# Altium schematic sheet Tower & AI.SchDoc
size A4
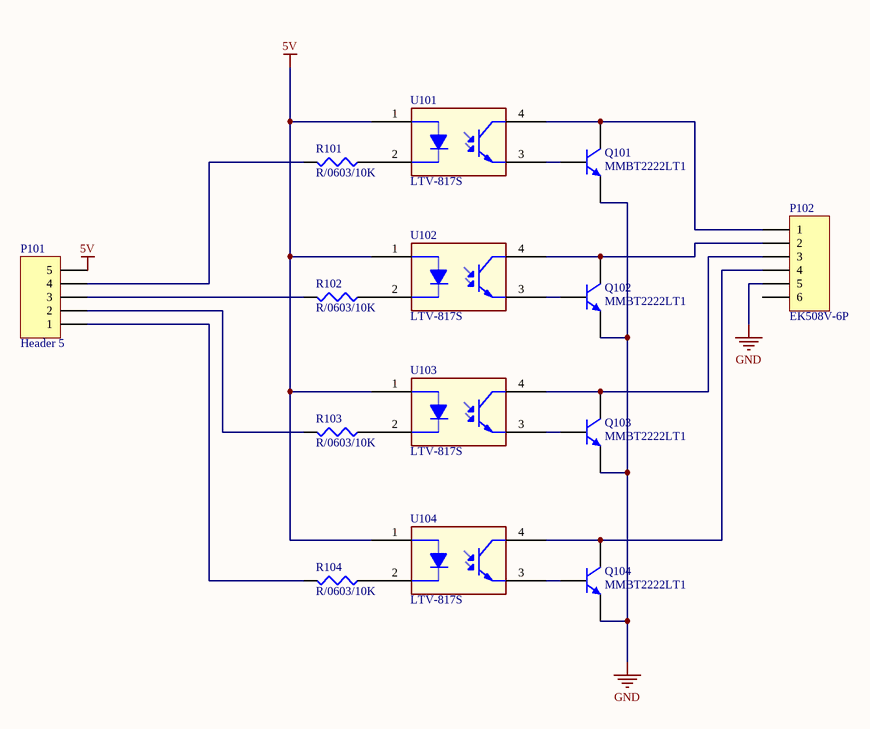
[diagram p0: Tower & AI.SchDoc]

## Parts
P101  Header 5  [HDR1X5]
P102  EK508V-6P  [EK508V-6P]
Q101  MMBT2222LT1  [SO-G3/C2.25]
Q102  MMBT2222LT1  [SO-G3/C2.25]
Q103  MMBT2222LT1  [SO-G3/C2.25]
Q104  MMBT2222LT1  [SO-G3/C2.25]
R101  R/0603/10K  [R_SMD_0603]
R102  R/0603/10K  [R_SMD_0603]
R103  R/0603/10K  [R_SMD_0603]
R104  R/0603/10K  [R_SMD_0603]
U101  LTV-817S  [U_SMD4_PC817]
U102  LTV-817S  [U_SMD4_PC817]
U103  LTV-817S  [U_SMD4_PC817]
U104  LTV-817S  [U_SMD4_PC817]

## Nets
5V: P101.5 U101.1(A) U102.1(A) U103.1(A) U104.1(A)
GND: P102.5 Q101.2(E) Q102.2(E) Q103.2(E) Q104.2(E)
NetP101_1: P101.1 R104.2
NetP101_2: P101.2 R103.2
NetP101_3: P101.3 R102.2
NetP101_4: P101.4 R101.2
NetP102_1: P102.1 Q101.3(C) U101.4(C)
NetP102_2: P102.2 Q102.3(C) U102.4(C)
NetP102_3: P102.3 Q103.3(C) U103.4(C)
NetP102_4: P102.4 Q104.3(C) U104.4(C)
NetQ101_1: Q101.1(B) U101.3(E)
NetQ102_1: Q102.1(B) U102.3(E)
NetQ103_1: Q103.1(B) U103.3(E)
NetQ104_1: Q104.1(B) U104.3(E)
NetR101_1: R101.1 U101.2(C)
NetR102_1: R102.1 U102.2(C)
NetR103_1: R103.1 U103.2(C)
NetR104_1: R104.1 U104.2(C)

Not connected (* = marked no-connect by the designer): P102 6

## Library data of the parts
P101 = Header 5: Header, 5-Pin; LatestRevisionDate: 17-Jul-2002; LatestRevisionNote: Re-released for DXP Platform.; Publisher: Altium Limited
Q101-Q104 = MMBT2222LT1: General Purpose Transistors  NPN Silicon
R101-R104 = Res: Resistor; Value: 10K
U101-U104 = LTV-817S: Single Photocoupler 80kHz